# Altium schematic sheet [11] - PROTECTED IO.SchDoc: PROTECTED IO
size B; Organization: Altium Limited; Address1: L3, 12a Rodborough Rd; Address2: Frenchs Forest; Address3: NSW; Address4: Australia 2086; DocumentNumber: 11; Revision: V1I1; SheetNumber: 11; SheetTotal: 16
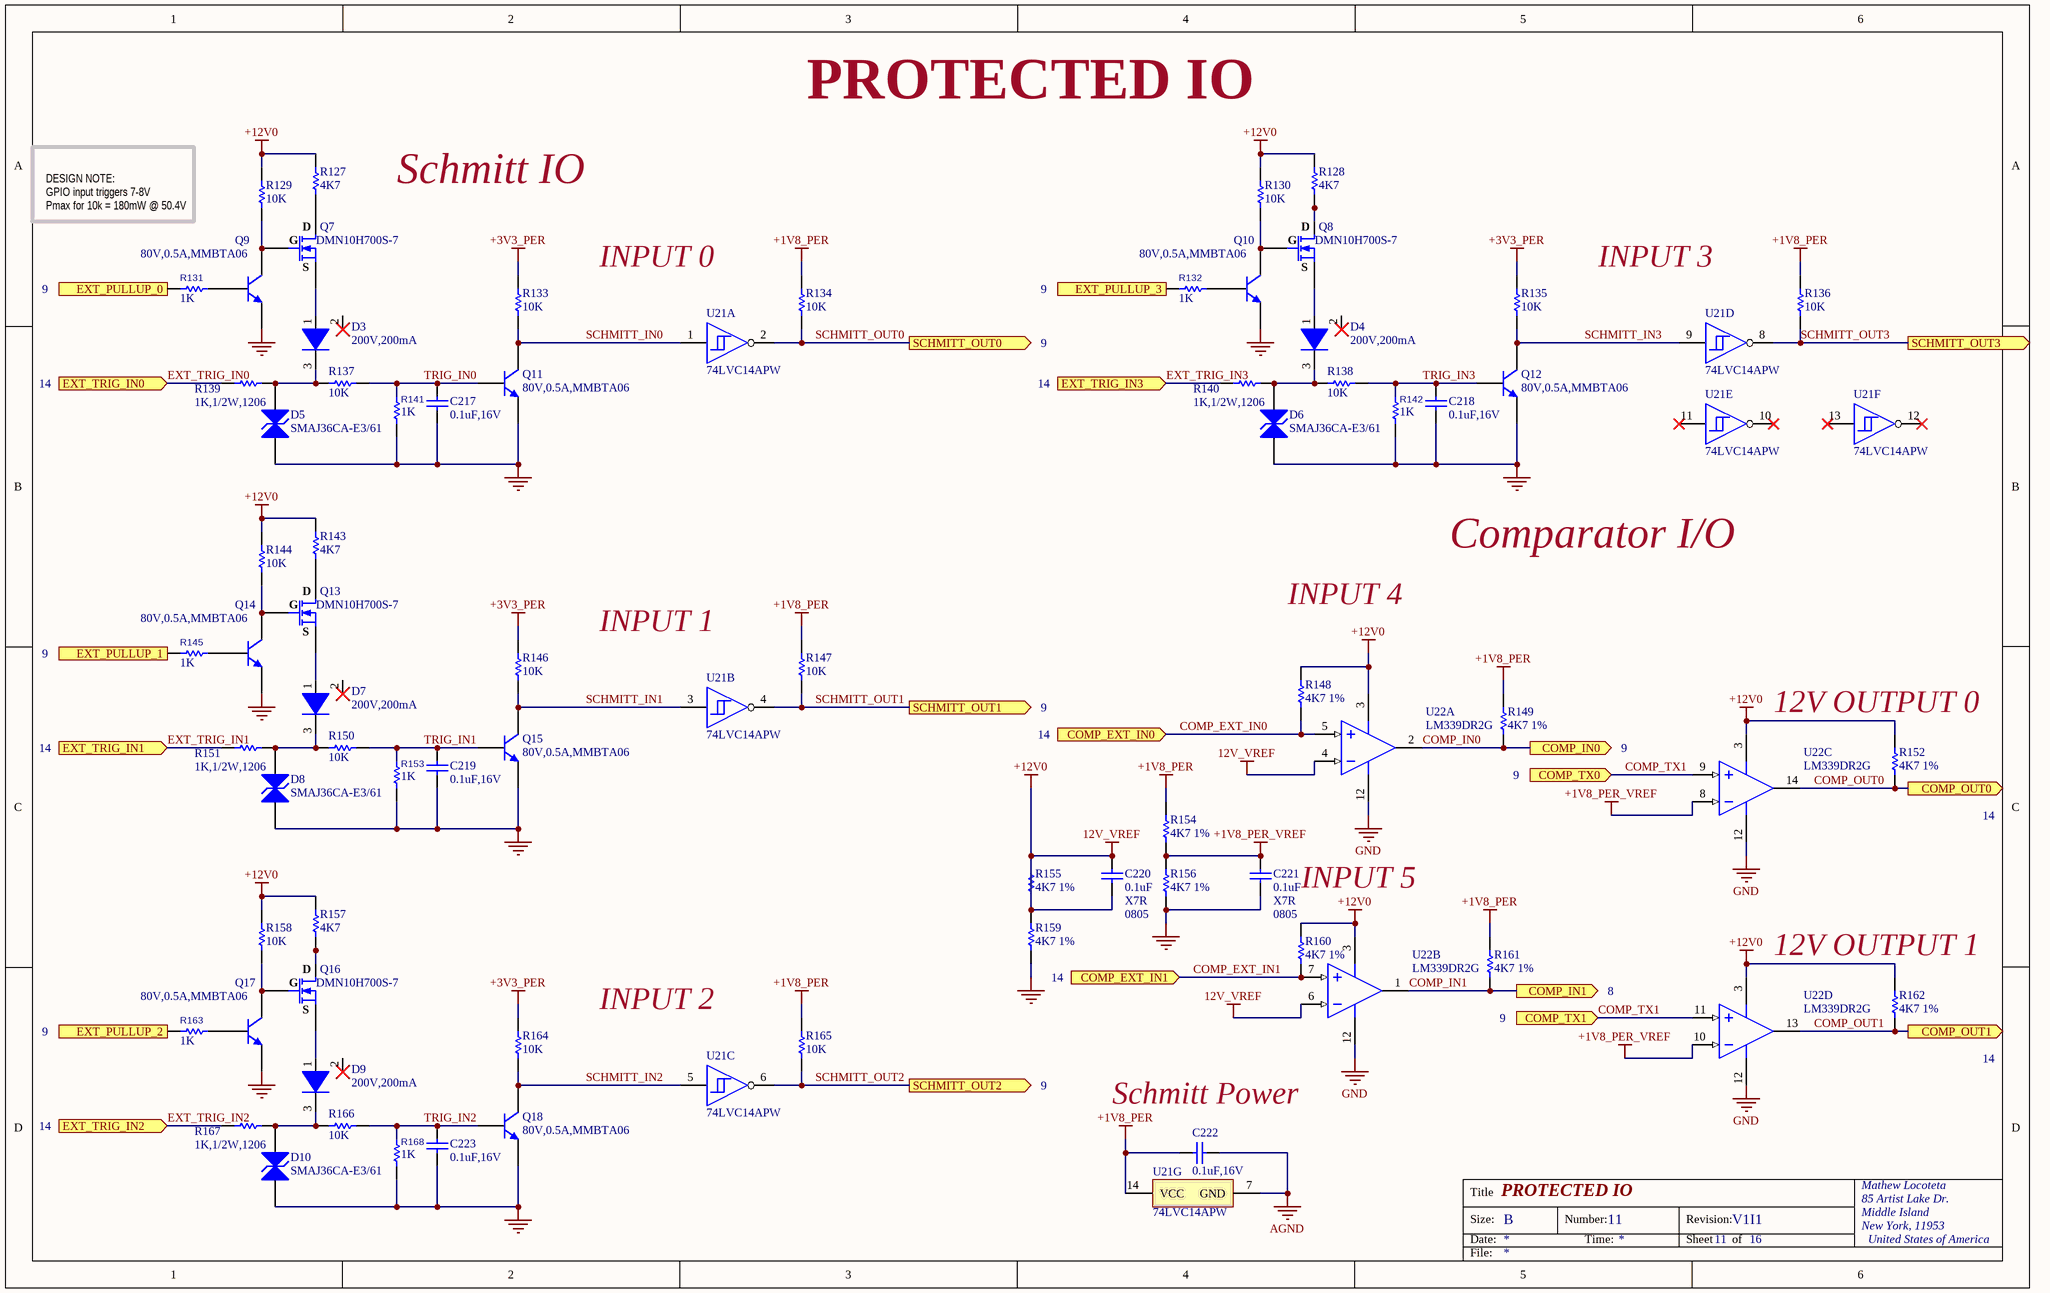
[diagram p0: [11] - PROTECTED IO.SchDoc]

## Parts
C217  0.1uF,16V  [C0402]
C218  0.1uF,16V  [C0402]
C219  0.1uF,16V  [C0402]
C220  0.1uF  Dielectric: X7R  Case Code (Imperial): 0805  [C0805]
C221  0.1uF  Dielectric: X7R  Case Code (Imperial): 0805  [C0805]
C222  0.1uF,16V  [C0402]
C223  0.1uF,16V  [C0402]
D3  200V,200mA  [SOT95P240X115-3N]
D4  200V,200mA  [SOT95P240X115-3N]
D5  SMAJ36CA-E3/61  [VISH-DO-214AC-2_L]
D6  SMAJ36CA-E3/61  [VISH-DO-214AC-2_L]
D7  200V,200mA  [SOT95P240X115-3N]
D8  SMAJ36CA-E3/61  [VISH-DO-214AC-2_L]
D9  200V,200mA  [SOT95P240X115-3N]
D10  SMAJ36CA-E3/61  [VISH-DO-214AC-2_L]
Q7  DMN10H700S-7  [SOT90P240X110-3N]
Q8  DMN10H700S-7  [SOT90P240X110-3N]
Q9  80V,0.5A,MMBTA06  [ONSC-SOT-23-3-318-08_V]
Q10  80V,0.5A,MMBTA06  [ONSC-SOT-23-3-318-08_V]
Q11  80V,0.5A,MMBTA06  [ONSC-SOT-23-3-318-08_V]
Q12  80V,0.5A,MMBTA06  [ONSC-SOT-23-3-318-08_V]
Q13  DMN10H700S-7  [SOT90P240X110-3N]
Q14  80V,0.5A,MMBTA06  [ONSC-SOT-23-3-318-08_V]
Q15  80V,0.5A,MMBTA06  [ONSC-SOT-23-3-318-08_V]
Q16  DMN10H700S-7  [SOT90P240X110-3N]
Q17  80V,0.5A,MMBTA06  [ONSC-SOT-23-3-318-08_V]
Q18  80V,0.5A,MMBTA06  [ONSC-SOT-23-3-318-08_V]
R127  4K7  [R0402]
R128  4K7  [R0402]
R129  10K  [R0603]
R130  10K  [R0603]
R131  1K  [R0402]
R132  1K  [R0402]
R133  10K  [R0603]
R134  10K  [R0603]
R135  10K  [R0603]
R136  10K  [R0603]
R137  10K  [R0603]
R138  10K  [R0603]
R139  1K,1/2W,1206  [R1206]
R140  1K,1/2W,1206  [R1206]
R141  1K  [R0402]
R142  1K  [R0402]
R143  4K7  [R0402]
R144  10K  [R0603]
R145  1K  [R0402]
R146  10K  [R0603]
R147  10K  [R0603]
R148  4K7 1%  [RESC0603(1608)_N]
R149  4K7 1%  [RESC0603(1608)_N]
R150  10K  [R0603]
R151  1K,1/2W,1206  [R1206]
R152  4K7 1%  [RESC0603(1608)_N]
R153  1K  [R0402]
R154  4K7 1%  [RESC0603(1608)_N]
R155  4K7 1%  [RESC0603(1608)_N]
R156  4K7 1%  [RESC0603(1608)_N]
R157  4K7  [R0402]
R158  10K  [R0603]
R159  4K7 1%  [RESC0603(1608)_N]
R160  4K7 1%  [RESC0603(1608)_N]
R161  4K7 1%  [RESC0603(1608)_N]
R162  4K7 1%  [RESC0603(1608)_N]
R163  1K  [R0402]
R164  10K  [R0603]
R165  10K  [R0603]
R166  10K  [R0603]
R167  1K,1/2W,1206  [R1206]
R168  1K  [R0402]
U21  74LVC14APW  [TSOP65P640X110-14N]  (parts A,B,C,D,E,F,G of 7)
U22  LM339DR2G  [ONSC-SOIC-14-751A-03_V]  (parts A,B,C,D of 4)

## Ports
COMP_EXT_IN0 (in), COMP_EXT_IN1 (in), COMP_IN0 (out), COMP_IN1 (out), COMP_OUT0 (out), COMP_OUT1 (out), COMP_TX0 (in), COMP_TX1 (in), EXT_PULLUP_0 (in), EXT_PULLUP_1 (in), EXT_PULLUP_2 (in), EXT_PULLUP_3 (in), EXT_TRIG_IN0 (in), EXT_TRIG_IN1 (in), EXT_TRIG_IN2 (in), EXT_TRIG_IN3 (in), SCHMITT_OUT0 (out), SCHMITT_OUT1 (out), SCHMITT_OUT2 (out), SCHMITT_OUT3 (out)

## Nets
+1V8_PER: C222.1 R134.2 R136.2 R147.2 R149.2 R154.2 R161.2 R165.2 U21.14(VCC)
+1V8_PER_VREF: C221.2 R154.1 R156.2 U22.8(IN3-) U22.10(IN4-)
+3V3_PER: R133.2 R135.2 R146.2 R164.2
+12V0: C220.1 C220.2 R127.2 R128.2 R129.1 R130.1 R143.2 R144.1 R148.2 R152.2 R155.1 R155.2 R157.2 R158.1 R159.2 R160.2 R162.2 U22.3(VCC) U22.4(IN1-) U22.6(IN2-)  [also labelled 12V_VREF]
AGND: C222.2 U21.7(GND)
GND: C217.2 C218.2 C219.2 C221.1 C223.2 D5.1(A1) D6.1(A1) D8.1(A1) D10.1(A1) Q9.2(E) Q10.2(E) Q11.2(E) Q12.2(E) Q14.2(E) Q15.2(E) Q17.2(E) Q18.2(E) R141.1 R142.1 R153.1 R156.1 R159.1 R168.1 U22.12(GND)
COMP_EXT_IN0: R148.1 U22.5(IN1+) ; port COMP_EXT_IN0
COMP_EXT_IN1: R160.1 U22.7(IN2+) ; port COMP_EXT_IN1
COMP_IN0: R149.1 U22.2(OUT1) ; port COMP_IN0
COMP_IN1: R161.1 U22.1(OUT2) ; port COMP_IN1
COMP_OUT0: R152.1 U22.14(OUT3) ; port COMP_OUT0
COMP_OUT1: R162.1 U22.13(OUT4) ; port COMP_OUT1
COMP_TX1: U22.9(IN3+) U22.11(IN4+) ; port COMP_TX0, port COMP_TX1
EXT_PULLUP_0: R131.2 ; port EXT_PULLUP_0
EXT_PULLUP_1: R145.2 ; port EXT_PULLUP_1
EXT_PULLUP_2: R163.2 ; port EXT_PULLUP_2
EXT_PULLUP_3: R132.2 ; port EXT_PULLUP_3
EXT_TRIG_IN0: R139.1 ; port EXT_TRIG_IN0
EXT_TRIG_IN1: R151.1 ; port EXT_TRIG_IN1
EXT_TRIG_IN2: R167.1 ; port EXT_TRIG_IN2
EXT_TRIG_IN3: R140.1 ; port EXT_TRIG_IN3
SCHMITT_IN0: Q11.3(C) R133.1 U21.1(1A)
SCHMITT_IN1: Q15.3(C) R146.1 U21.3(2A)
SCHMITT_IN2: Q18.3(C) R164.1 U21.5(3A)
SCHMITT_IN3: Q12.3(C) R135.1 U21.9(4A)
SCHMITT_OUT0: R134.1 U21.2(~{1Y}) ; port SCHMITT_OUT0
SCHMITT_OUT1: R147.1 U21.4(~{2Y}) ; port SCHMITT_OUT1
SCHMITT_OUT2: R165.1 U21.6(~{3Y}) ; port SCHMITT_OUT2
SCHMITT_OUT3: R136.1 U21.8(~{4Y}) ; port SCHMITT_OUT3
TRIG_IN0: C217.1 Q11.1(B) R137.2 R141.2
TRIG_IN1: C219.1 Q15.1(B) R150.2 R153.2
TRIG_IN2: C223.1 Q18.1(B) R166.2 R168.2
TRIG_IN3: C218.1 Q12.1(B) R138.2 R142.2
NetD3_1: D3.1(A) Q7.2(S)
NetD3_3: D3.3(K) D5.2(A2) R137.1 R139.2
NetD4_1: D4.1(A) Q8.2(S)
NetD4_3: D4.3(K) D6.2(A2) R138.1 R140.2
NetD7_1: D7.1(A) Q13.2(S)
NetD7_3: D7.3(K) D8.2(A2) R150.1 R151.2
NetD9_1: D9.1(A) Q16.2(S)
NetD9_3: D9.3(K) D10.2(A2) R166.1 R167.2
NetQ7_1: Q7.1(G) Q9.3(C) R129.2
NetQ7_3: Q7.3(D) R127.1
NetQ8_1: Q8.1(G) Q10.3(C) R130.2
NetQ8_3: Q8.3(D) R128.1
NetQ9_1: Q9.1(B) R131.1
NetQ10_1: Q10.1(B) R132.1
NetQ13_1: Q13.1(G) Q14.3(C) R144.2
NetQ13_3: Q13.3(D) R143.1
NetQ14_1: Q14.1(B) R145.1
NetQ16_1: Q16.1(G) Q17.3(C) R158.2
NetQ16_3: Q16.3(D) R157.1
NetQ17_1: Q17.1(B) R163.1

Not connected (* = marked no-connect by the designer): D3 2(A); D4 2(A); D7 2(A); D9 2(A); U21 10(~{5Y})* 11(5A)* 12(~{6Y})* 13(6A)*

## Notes on the sheet
- PROTECTED IO
- DESIGN NOTE:
  GPIO input triggers 7-8V
  Pmax for 10k = 180mW @ 50.4V
- Schmitt IO
- 9
- INPUT 0
- INPUT 3
- 14
- Comparator I/O
- INPUT 1
- INPUT 4
- (near R149) 9
- 12V OUTPUT 0
- INPUT 5
- (near R159) 14
- 12V OUTPUT 1
- INPUT 2
- (near R161) 9
- 8
- Schmitt Power
- Title
- Size:
- Date:
- B
- Number:
- Time:
- Revision:
- Sheet
- of
- Mathew Locoteta
- 85 Artist Lake Dr.
- Middle Island
- New York, 11953
- United States of America
- File:

## Library data of the parts
C217-C219 C222 C223 = CL05B104KO5VPNC: CAP CER 0.1UF 16V X7R 0402; Manufacturer: Samsung; Capacitance: 100nF; Tolerance: 10%; Supplier 1: Digi-Key; Manufacturer Part Number: CL05B104KO5VPNC; Stock 1: 940680; Pricing 1: 1=0.10000, 10=0.02600, 100=0.01140, 500=0.00812, 1000=0.00638, 2500=0.00580, 5000=0.00534 (USD); RoHS: Yes; Mount: Surface Mount; Case/Package: 0402; Case Code (Metric): 1005; Case Code (Imperial): 0402; Min Operating Temperature: -55°C; Max Operating Temperature: 125°C; Packaging: Cut Tape; Voltage Rating: 16V; Features: Soft Termination; Length: 0.039inch; Width: 0.02inch; Thickness: 0.022inch; Ratings: AEC-Q200; Lead Free: Lead Free; ComponentLink1URL: http://components.arrow.com/part/dataview/0323_06933256?src-supplier=Arrow+Europe; ComponentLink1Description: http://components.arrow.com/part/dataview/0323_06933256?src-supplier=Arrow+Europe; ComponentLink2URL: http://www.samsungsem.com/kr/support/library/product-catalog/mlcc.jsp?src-supplier=Digi-Key; ComponentLink2Description: http://www.samsungsem.com/kr/support/library/product-catalog/mlcc.jsp?src-supplier=Digi-Key; ComponentLink3URL: http://www.farnell.com/datasheets/2710692.pdf?src-supplier=Newark; ComponentLink3Description: http://www.farnell.com/datasheets/2710692.pdf?src-supplier=Newark; ComponentLink4URL: http://www.samsungsem.com/kr/support/product-search/mlcc/CL05B104KO5VPNC.jsp?src-supplier=Digi-Key; ComponentLink4Description: http://www.samsungsem.com/kr/support/product-search/mlcc/CL05B104KO5VPNC.jsp?src-supplier=Digi-Key; ComponentLink5URL: http://www.samsungsem.com/servlet/FileDownload?type=spec&file=CL05B104KO5VPNC.pdf&src-supplier=Avnet; ComponentLink5Description: http://www.samsungsem.com/servlet/FileDownload?type=spec&file=CL05B104KO5VPNC.pdf&src-supplier=Avnet; Supplier Part Number 1: 1276-6844-1-ND
C220 C221 = CL21B104KCFWPNE: CAP CER 0.1UF 100V X7R 0805; Manufacturer: Samsung; Capacitance: 100nF; Tolerance: 10%; Supplier 1: Digi-Key; Manufacturer Part Number: CL21B104KCFWPNE; Stock 1: 283289; Pricing 1: 1=0.16000, 10=0.11200, 100=0.05250, 500=0.03684, 1000=0.03050 (USD); RoHS: Yes; Mount: Surface Mount; Case/Package: 0805; Case Code (Metric): 2012; Min Operating Temperature: -55°C; Max Operating Temperature: 125°C; Packaging: Tape and Reel; Features: Soft Termination; Length: 0.079inch; Width: 0.049inch; Thickness: 0.053inch; Ratings: AEC-Q200; ComponentLink1URL: http://www.samsungsem.com/servlet/FileDownload?type=spec&file=CL21B104KCFWPNE.pdf&src-supplier=Avnet; ComponentLink1Description: http://www.samsungsem.com/servlet/FileDownload?type=spec&file=CL21B104KCFWPNE.pdf&src-supplier=Avnet; ComponentLink2URL: http://www.samsungsem.com/kr/support/product-search/mlcc/CL21B104KCFWPNE.jsp?src-supplier=Digi-Key; ComponentLink2Description: http://www.samsungsem.com/kr/support/product-search/mlcc/CL21B104KCFWPNE.jsp?src-supplier=Digi-Key; Supplier Part Number 1: 1276-6733-1-ND; Voltage Rating: 100V
D3 D4 D7 D9 = BAS21HMFHT116: DIODE GEN PURP 200V 200MA SSD3; Manufacturer: Rohm; Reverse Recovery Time: 50ns; Supplier 1: Mouser; Manufacturer Part Number: BAS21HMFHT116; Stock 1: 35226; Pricing 1: 1=0.13000, 10=0.12000, 50=0.12000, 100=0.04000, 1000=0.02700, 10000=0.02700 (USD); RoHS: No; Mount: Surface Mount; Case/Package: TO-236-3; Packaging: Cut Tape; Max Reverse Voltage (DC): 200V; Average Rectified Current: 200mA; ComponentLink1URL: https://www.rohm.com/datasheet/BAS21HMFH/bas21hmfht116-e?src-supplier=Digi-Key; ComponentLink1Description: https://www.rohm.com/datasheet/BAS21HMFH/bas21hmfht116-e?src-supplier=Digi-Key; Supplier Part Number 1: 755-BAS21HMFHT116
D5 D6 D8 D10 = CMP-0548-00213-2: Transient Voltage Suppressor, 6.40 to 231 V, 36 V Stand-off Voltage, Bi-Directional, -55 to 155 degC, 2-pin DO-214AC, Pb-Free, Tape and Reel; Manufacturer: Vishay Semiconductor; IFSM: 40 A; VBR Bi-Directional (V): 6.4 to 231; PPPM (W): 400, 300; ID (uA): 2; VWM (V): 36; DatasheetVersion: 12/8/2013; ComponentLink2URL: http://www.vishay.com/docs/88390/smaj50a.pdf; Packing: Tape and Reel; PartNumber: SMAJ36CA-E3/61; ComponentLink3URL: http://www.vishay.com/docs/88390/smaj50a.pdf; Operating Junction and Storage Temperature Range: -55 to 150 degC; Mounting Technology: Surface Mount; ComponentLink1Description: Manufacturer URL; ComponentLink2Description: Datasheet; PackageReference: DO-214AC-2; ComponentLink3Description: Package Specification; RoHS: TRUE; ComponentLink1URL: http://www.vishay.com/; PackageDescription: 2-Pin DO-214AC (SMA), Body 4.245 x 2.665 mm
Q7 Q8 Q13 Q16 = DMN10H700S-7: MOSFET N-CHA 100V 700MA SOT23; Manufacturer: Diodes; Rds On Max: 700mR; Input Capacitance: 235pF; Max Power Dissipation: 400mW; Supplier 1: Digi-Key; Manufacturer Part Number: DMN10H700S-7; Stock 1: 12863; Pricing 1: 1=0.41000, 10=0.30800, 100=0.17450, 500=0.11556, 1000=0.08860 (USD); RoHS: Yes; Mount: Surface Mount; Case/Package: TO-236-3; Min Operating Temperature: -55°C; Max Operating Temperature: 150°C; Packaging: Tape and Reel; Drain to Source Voltage (Vdss): 100V; Continuous Drain Current (ID): 700mA; ComponentLink1URL: https://www.diodes.com/assets/Datasheets/DMN10H700S.pdf?src-supplier=Digi-Key; ComponentLink1Description: https://www.diodes.com/assets/Datasheets/DMN10H700S.pdf?src-supplier=Digi-Key; Supplier Part Number 1: DMN10H700S-7DICT-ND
Q9-Q12 Q14 Q15 Q17 Q18 = MMBTA06LT1G: TRANS NPN 80V 0.5A SOT23; Manufacturer: ON Semiconductor; Max Power Dissipation: 225mW; Number of Elements: 1; Frequency: 100MHz; Emitter Base Voltage (VEBO): 4V; Collector Emitter Saturation Voltage: 250mV; Max Collector Current: 500mA; Power Dissipation: 300mW; Element Configuration: Single; hFE Min: 100; Supplier 1: Digi-Key; Manufacturer Part Number: MMBTA06LT1G; Stock 1: 502614; Pricing 1: 1=0.19000, 10=0.17000, 100=0.09230, 500=0.05682, 1000=0.03874 (USD); RoHS: Yes; Case/Package: SOT-23-3; Number of Pins: 3; Contact Plating: Tin,Matte; Min Operating Temperature: -55°C; Max Operating Temperature: 150°C; Package Quantity: 1; Collector Emitter Voltage (VCEO): 80V; Packaging: Tape and Reel; Polarity: NPN; Collector Base Voltage (VCBO): 80V; Collector Emitter Breakdown Voltage: 80V; Transition Frequency: 100MHz; Max Breakdown Voltage: 80V; Max Frequency: 100MHz; Gain Bandwidth Product: 100MHz; Voltage Rating (DC): 80V; Current Rating: 500mA; Length: 0.119inch; Height: 0.04inch; Width: 0.055inch; Radiation Hardening: No; REACH SVHC: No SVHC; Lead Free: Lead Free; ComponentLink1URL: https://datasheet.ciiva.com/4722/mmbta05lt1-d-101659-4722113.pdf?src-supplier=Mouser; ComponentLink1Description: https://datasheet.ciiva.com/4722/mmbta05lt1-d-101659-4722113.pdf?src-supplier=Mouser; ComponentLink2URL: https://datasheet.ciiva.com/15139/getdatasheetpartid-137838-15139444.pdf?src-supplier=Verical; ComponentLink2Description: https://datasheet.ciiva.com/15139/getdatasheetpartid-137838-15139444.pdf?src-supplier=Verical; ComponentLink3URL: https://datasheet.ciiva.com/11197/mmbta05lt1-d-11197414.pdf?src-supplier=Avnet; ComponentLink3Description: https://datasheet.ciiva.com/11197/mmbta05lt1-d-11197414.pdf?src-supplier=Avnet; ComponentLink4URL: https://datasheet.ciiva.com/976/mmbta05lt1-d-976473.pdf?src-supplier=Digi-Key; ComponentLink4Description: https://datasheet.ciiva.com/976/mmbta05lt1-d-976473.pdf?src-supplier=Digi-Key; ComponentLink5URL: https://datasheet.ciiva.com/976/mmbta05lt1-d-976474.pdf?src-supplier=Digi-Key; ComponentLink5Description: https://datasheet.ciiva.com/976/mmbta05lt1-d-976474.pdf?src-supplier=Digi-Key; ComponentLink6URL: https://datasheet.ciiva.com/25998/mmbta05lt1-d-25998830.pdf?src-supplier=Avnet+Europe; ComponentLink6Description: https://datasheet.ciiva.com/25998/mmbta05lt1-d-25998830.pdf?src-supplier=Avnet+Europe; ComponentLink7URL: https://datasheet.ciiva.com/16465/mmbta05lt1-d-16465685.pdf?src-supplier=Future+Electronics; ComponentLink7Description: https://datasheet.ciiva.com/16465/mmbta05lt1-d-16465685.pdf?src-supplier=Future+Electronics; ComponentLink8URL: https://datasheet.ciiva.com/11198/mmbta05lt1-d-11198678.pdf?src-supplier=Avnet; ComponentLink8Description: https://datasheet.ciiva.com/11198/mmbta05lt1-d-11198678.pdf?src-supplier=Avnet; ComponentLink9URL: https://datasheet.ciiva.com/976/mmbta05lt1-d-976475.pdf?src-supplier=Digi-Key; ComponentLink9Description: https://datasheet.ciiva.com/976/mmbta05lt1-d-976475.pdf?src-supplier=Digi-Key; ComponentLink10URL: https://datasheet.ciiva.com/7972/mmbta05lt1-d-7972078.pdf?src-supplier=Element14; ComponentLink10Description: https://datasheet.ciiva.com/7972/mmbta05lt1-d-7972078.pdf?src-supplier=Element14; ComponentLink11URL: https://datasheet.ciiva.com/16478/mmbta05lt1-d-16478574.pdf?src-supplier=Avnet+Asia; ComponentLink11Description: https://datasheet.ciiva.com/16478/mmbta05lt1-d-16478574.pdf?src-supplier=Avnet+Asia; Supplier Part Number 1: MMBTA06LT1GOSCT-ND
R127 R128 R143 R157 = RMCF0402FT4K70: RES 4.7K OHM 1% 1/16W 0402; Manufacturer: Stackpole Electronics; Resistance: 4.7kR; Max Power Dissipation: 63mW; Temperature Coefficient: 100ppm/°C; Supplier 1: Digi-Key; Manufacturer Part Number: RMCF0402FT4K70; Stock 1: 817929; Pricing 1: 1=0.10000, 10=0.01500, 100=0.00610, 1000=0.00275, 2500=0.00239, 5000=0.00198 (USD); RoHS: Yes; Mount: Surface Mount; Case/Package: 0402; Case Code (Metric): 1005; Case Code (Imperial): 0402; Contact Plating: Tin,Matte; Min Operating Temperature: -55°C; Max Operating Temperature: 155°C; Packaging: Tape and Reel; Tolerance: 1%; Composition: Thick Film; Number of Terminations: 2; Military Standard: Not; Features: Automotive AEC-Q200; Length: 1mm; Height: 0.016inch; Width: 0.02inch; Depth: 0.5mm; Radiation Hardening: No; Lead Free: Lead Free; ComponentLink1URL: https://datasheet.ciiva.com/26936/getdatasheetpartid-743577-26936605.pdf?src-supplier=Verical; ComponentLink1Description: https://datasheet.ciiva.com/26936/getdatasheetpartid-743577-26936605.pdf?src-supplier=Verical; Supplier Part Number 1: RMCF0402FT4K70CT-ND
R129 R130 R133-R138 R144 R146 R147 R150 R158 R164-R166 = RMCF0603FT10K0: RES 10K OHM 1% 1/10W 0603; Manufacturer: Stackpole Electronics; Resistance: 10kR; Power Rating: 100mW; Temperature Coefficient: 100ppm/°C; Supplier 1: Digi-Key; Manufacturer Part Number: RMCF0603FT10K0; Stock 1: 2968232; Pricing 1: 1=0.10000, 10=0.01700, 100=0.00680, 1000=0.00306, 2500=0.00266 (USD); RoHS: Yes; Mount: Surface Mount; Case/Package: 0603; Case Code (Metric): 1608; Case Code (Imperial): 0603; Contact Plating: Tin,Matte; Min Operating Temperature: -55°C; Max Operating Temperature: 155°C; Tolerance: 1%; Packaging: Tape and Reel; Composition: Thick Film; Number of Terminations: 2; Military Standard: Not; Max Power Dissipation: 100mW; Features: Automotive AEC-Q200; Length: 1.55mm; Height: 0.022inch; Width: 0.031inch; Depth: 0.8mm; Radiation Hardening: No; Lead Free: Lead Free; ComponentLink1URL: http://components.arrow.com/part/dataview/43747082S6756917N1174?src-supplier=Arrow; ComponentLink1Description: http://components.arrow.com/part/dataview/43747082S6756917N1174?src-supplier=Arrow; ComponentLink2URL: https://www.seielect.com/catalog/sei-rmcf_rmcp.pdf?src-supplier=Digi-Key; ComponentLink2Description: https://www.seielect.com/catalog/sei-rmcf_rmcp.pdf?src-supplier=Digi-Key; ComponentLink3URL: https://www.seielect.com/catalog/SEI-RMCF_RMCP.pdf?src-supplier=Avnet; ComponentLink3Description: https://www.seielect.com/catalog/SEI-RMCF_RMCP.pdf?src-supplier=Avnet; ComponentLink4URL: http://www.seielect.com/catalog/sei-rmc.pdf?src-supplier=Future+Electronics; ComponentLink4Description: http://www.seielect.com/catalog/sei-rmc.pdf?src-supplier=Future+Electronics; ComponentLink5URL: https://www.verical.com/server-webapp/html/getDatasheet?partID=360913&src-supplier=Verical; ComponentLink5Description: https://www.verical.com/server-webapp/html/getDatasheet?partID=360913&src-supplier=Verical; Supplier Part Number 1: RMCF0603FT10K0CT-ND
R131 R132 R141 R142 R145 R153 R163 R168 = RMCF0402FT1K00: RES 1K OHM 1% 1/16W 0402; Manufacturer: Stackpole Electronics; Resistance: 1kR; Power Rating: 63mW; Temperature Coefficient: 100ppm/°C; Supplier 1: Digi-Key; Manufacturer Part Number: RMCF0402FT1K00; Stock 1: 1254280; Pricing 1: 1=0.10000, 10=0.01500, 100=0.00610, 1000=0.00275, 2500=0.00239, 5000=0.00198 (USD); RoHS: Yes; Mount: Surface Mount; Case/Package: 0402; Case Code (Metric): 1005; Case Code (Imperial): 0402; Contact Plating: Tin,Matte; Min Operating Temperature: -55°C; Max Operating Temperature: 155°C; Packaging: Tape and Reel; Tolerance: 1%; Composition: Thick Film; Number of Terminations: 2; Military Standard: Not; Max Power Dissipation: 63mW; Features: Automotive AEC-Q200; Length: 1mm; Height: 0.016inch; Width: 0.02inch; Depth: 0.5mm; Radiation Hardening: No; Lead Free: Lead Free; ComponentLink1URL: https://datasheet.ciiva.com/15193/getdatasheetpartid-365385-15193418.pdf?src-supplier=Verical; ComponentLink1Description: https://datasheet.ciiva.com/15193/getdatasheetpartid-365385-15193418.pdf?src-supplier=Verical; ComponentLink2URL: https://datasheet.ciiva.com/24336/sei-rmcp-24336266.pdf?src-supplier=Onlinecomponents.com; ComponentLink2Description: https://datasheet.ciiva.com/24336/sei-rmcp-24336266.pdf?src-supplier=Onlinecomponents.com; Supplier Part Number 1: RMCF0402FT1K00CT-ND; Supplier 2: Digi-Key; Supplier Part Number 2: 541-1.00KLCT-ND
R139 R140 R151 R167 = RNCP1206FTD1K00: RES 1K OHM 1% 1/2W 1206; Manufacturer: Stackpole Electronics; Resistance: 1kR; Max Power Dissipation: 500mW; Temperature Coefficient: 100ppm/°C; Supplier 1: Digi-Key; Manufacturer Part Number: RNCP1206FTD1K00; Stock 1: 275498; Pricing 1: 1=0.10000, 10=0.09300, 100=0.03580, 1000=0.01575, 2500=0.01360 (USD); RoHS: Yes; Mount: Surface Mount; Case/Package: 1206; Case Code (Metric): 3216; Case Code (Imperial): 1206; Contact Plating: Tin,Matte; Min Operating Temperature: -55°C; Max Operating Temperature: 155°C; Tolerance: 1%; Packaging: Tape and Reel; Composition: Thin Film; Number of Terminations: 2; Features: Moisture Resistant,Anti-Sulfur; Length: 0.122inch; Height: 0.024inch; Width: 0.059inch; Radiation Hardening: No; Lead Free: Lead Free; ComponentLink1URL: https://www.seielect.com/catalog/SEI-Packaging.pdf?src-supplier=Digi-Key; ComponentLink1Description: https://www.seielect.com/catalog/SEI-Packaging.pdf?src-supplier=Digi-Key; ComponentLink2URL: http://www.seielect.com/Catalog/SEI-rncp.pdf?src-supplier=Avnet; ComponentLink2Description: http://www.seielect.com/Catalog/SEI-rncp.pdf?src-supplier=Avnet; Supplier Part Number 1: RNCP1206FTD1K00CT-ND
R148 R149 R152 R154-R156 R159-R162 = CMP-1012-00586-1: 4K7 0.1W 1% 0603 (1608 Metric)  SMD; Case-EIA: 0603; Case-Metric: 1608; Value: 4700.00 Ohm; Power: 0.1 W; Tolerance: 1 %; Technology: SMT
U21 = 74LVC14APW-Q100J: IC SCHMITT TRIG HEX INV 14TSSOP; Manufacturer: NXP Semiconductors; Logic Function: Schmitt Trigger,Inverter; Low Level Output Current: 24mA; High Level Output Current: -24mA; Quiescent Current: 100nA; Propagation Delay: 14.7ns; Max Supply Voltage: 3.6V; Min Supply Voltage: 1.2V; Number of Elements: 6; Supplier 1: Digi-Key; Manufacturer Part Number: 74LVC14APW-Q100J; Stock 1: 4855; Pricing 1: 1=0.36000, 10=0.29400, 25=0.26880, 100=0.20010, 250=0.18132, 500=0.15004, 1000=0.11254 (USD); RoHS: Yes; Mount: Surface Mount; Case/Package: TSSOP; Number of Pins: 14; Min Operating Temperature: -40°C; Max Operating Temperature: 125°C; Packaging: Tape and Reel; Radiation Hardening: No; Lead Free: Lead Free; ComponentLink1URL: https://datasheet.ciiva.com/15012/74lvc14a-q100-15012081.pdf?src-supplier=Digi-Key; ComponentLink1Description: https://datasheet.ciiva.com/15012/74lvc14a-q100-15012081.pdf?src-supplier=Digi-Key; Supplier Part Number 1: 1727-8412-1-ND
U22 = CMP-1305-00036-1: Single Supply Quad Comparators, 0 to 70 degC, 14-Pin SOIC, Pb-Free, Tape and Reel; Manufacturer: On Semiconductor; IO Typ (mA): 16; ComponentLink3URL: http://www.onsemi.com/pub_link/Collateral/751A-03.PDF; RoHS: TRUE; Packing: Tape and Reel; ComponentLink2Description: Datasheet; ComponentLink2URL: http://www.onsemi.com/pub_link/Collateral/LM339-D.PDF; ComponentLink1Description: Manufacturer URL; PackageVersion: Rev. K, 05/2011; DatasheetVersion: Rev. 20; PackageReference: SOIC-14-751A-03; ComponentLink1URL: http://www.onsemi.com/; PartNumber: LM339DR2G; PackageDescription: 14-Pin Small Outline Integrated Circuit, Body 8.65 x 3.9 mm, Pitch 1.27 mm; ComponentLink3Description: Package Specification; Mounting Technology: Surface Mount